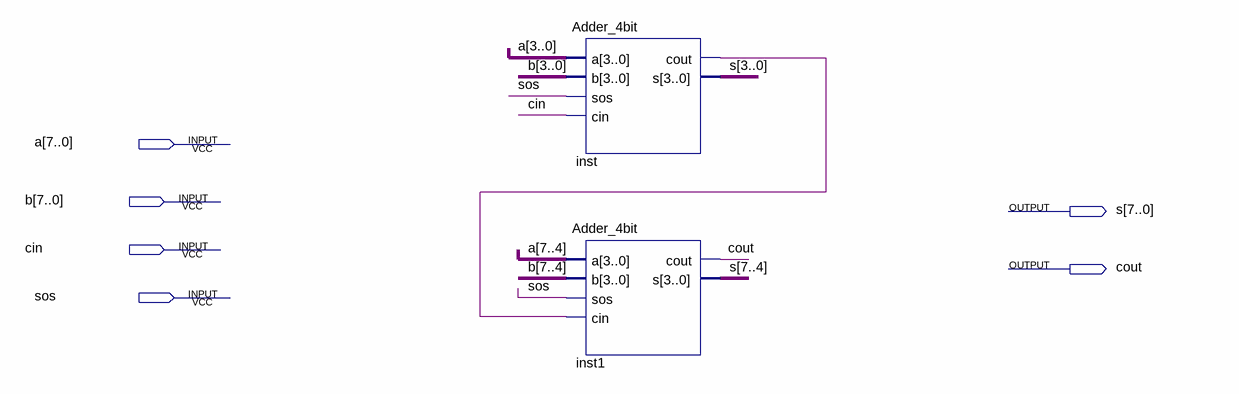
[diagram p0: schematic sheet]
// Quartus schematic Adder_8bit.bdf as structural Verilog: 2 symbols, 6 pins
module Adder_8bit (
  input  [7:0] a,
  input  [7:0] b,
  input  cin,
  input  sos,
  output [7:0] s,
  output cout
);

  wire inst_cout;

  Adder_4bit inst (.a(a[3:0]), .b(b[3:0]), .sos(sos), .cin(cin), .cout(inst_cout), .s(s[3:0]));
  Adder_4bit inst1 (.a(a[7:4]), .b(b[7:4]), .sos(sos), .cin(inst_cout), .cout(cout), .s(s[7:4]));
endmodule
